# Altium project karmanDB_pcb.PrjPcb (part 1 of 3)
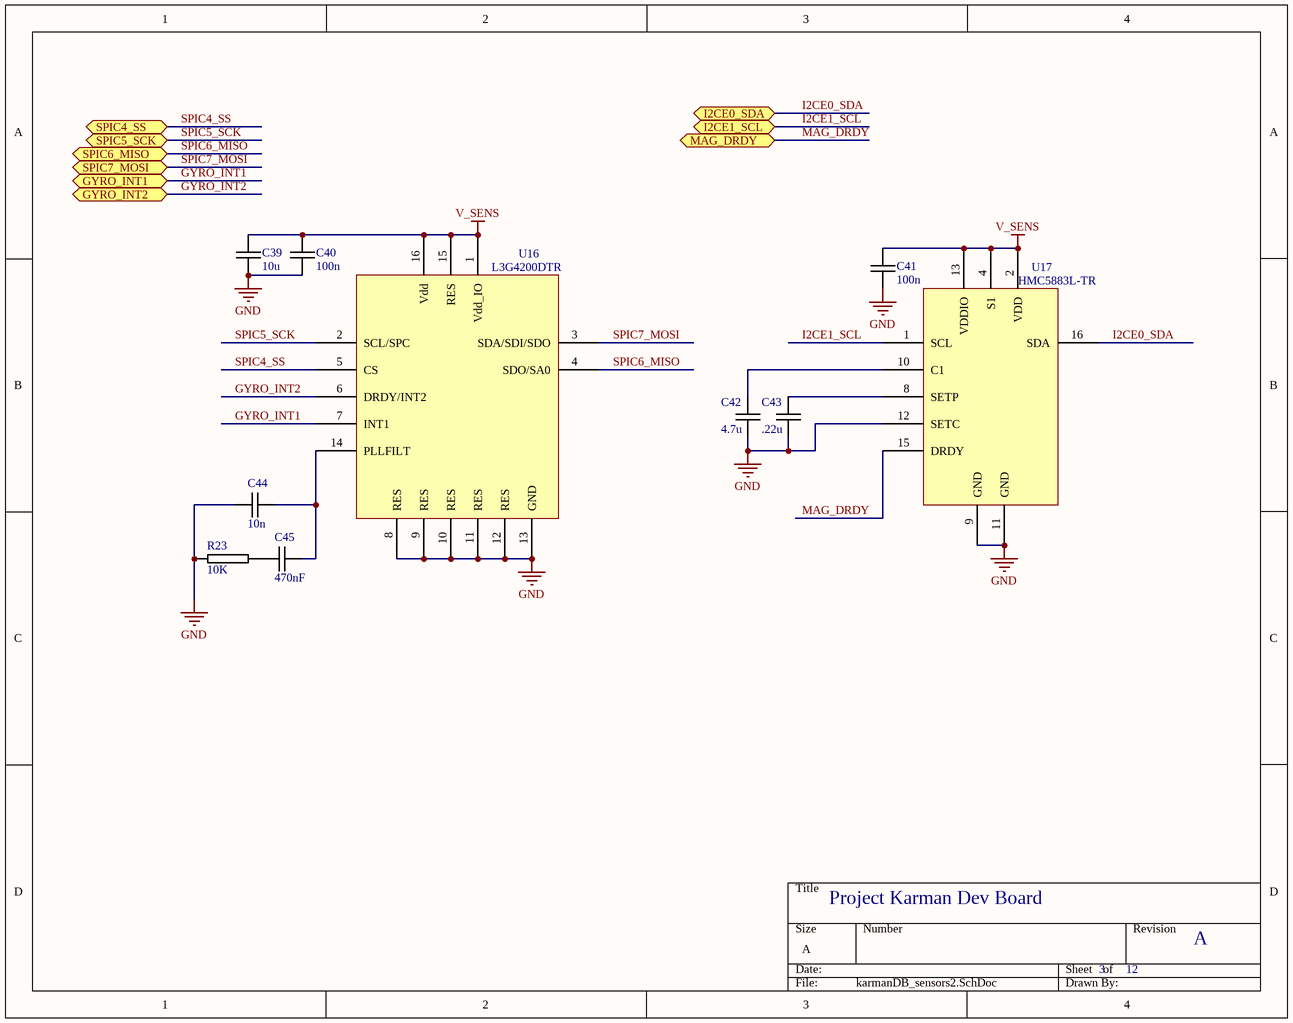
[diagram p0: karmanDB_sensors2.SchDoc]
12 sheets, 205 parts. Net scope: flat (ports and power ports of the same name join across sheets).
Board file: karmanDB.PcbDoc
Sheets:
  karmanDB_sensors2.SchDoc
  karmanDB_accel.SchDoc
  karmanDB_sensors1.SchDoc
  karmanDB_MCU.SchDoc
  karmanDB_power.SchDoc
  karmanDB_transceiver.SchDoc
  karmanDB_mem.SchDoc
  karmanDB_gps&gs.SchDoc
  karmanDB_camera.SchDoc
  karmanDB_amp.SchDoc
  karmanDB_pyro.SchDoc
  karmanDB_testpoints.SchDoc

## Sheet karmanDB_sensors2.SchDoc
size A

### Parts
C39  10u  [MURATA_GRM_0603]
C40  100n  [MURATA_GRM_0603]
C41  100n  [MURATA_GRM_0603]
C42  4.7u  [MURATA_GRM_0603]
C43  .22u  [MURATA_GRM_0603]
C44  10n  [MURATA_GRM_0402]
C45  470nF  [MURATA_GRM_0402]
R23  10K  [PANASONIC_ERJ3R]
U16  L3G4200DTR  [4 L3G4200D]
U17  HMC5883L-TR  [5 HMC5883L-TR]

### Ports
GYRO_INT1 (bidir), GYRO_INT2 (bidir), I2CE0_SDA (bidir), I2CE1_SCL (bidir), MAG_DRDY (bidir), SPIC4_SS (bidir), SPIC5_SCK (bidir), SPIC6_MISO (bidir), SPIC7_MOSI (bidir)

### Nets
GND: C39.2 C40.2 C41.2 C42.2 C43.2 C44.1 R23.1 U16.8(RES) U16.9(RES) U16.10(RES) U16.11(RES) U16.12(RES) U16.13(GND) U17.9(GND) U17.11(GND) U17.12(SETC)
V_SENS: C39.1 C40.1 C41.1 U16.1(Vdd_IO) U16.15(RES) U16.16(Vdd) U17.2(VDD) U17.4(S1) U17.13(VDDIO)
GYRO_INT1: U16.7(INT1) ; port GYRO_INT1
GYRO_INT2: U16.6(DRDY/INT2) ; port GYRO_INT2
I2CE0_SDA: U17.16(SDA) ; port I2CE0_SDA
I2CE1_SCL: U17.1(SCL) ; port I2CE1_SCL
MAG_DRDY: U17.15(DRDY) ; port MAG_DRDY
SPIC4_SS: U16.5(CS) ; port SPIC4_SS
SPIC5_SCK: U16.2(SCL/SPC) ; port SPIC5_SCK
SPIC6_MISO: U16.4(SDO/SA0) ; port SPIC6_MISO
SPIC7_MOSI: U16.3(SDA/SDI/SDO) ; port SPIC7_MOSI
NetC42_1: C42.1 U17.10(C1)
NetC43_1: C43.1 U17.8(SETP)
NetC44_2: C44.2 C45.2 U16.14(PLLFILT)
NetC45_1: C45.1 R23.2

### Notes on the sheet
- Project Karman Dev Board
- 3
- 12
- A

### Library data of the parts
C39 = CAP_MURATA_GRM188R60J106: CAP CER 10UF 6.3V 20% X5R 0603; Manufacturer: Murata Electronics North America; Manufacturer Part Number: GRM188R60J106ME47J; Capacitance: 10µF; Supplier 1: Digi-Key; Supplier Part Number 1: 490-6405-1-ND; RoHS: RoHS Compliant; Category: Capacitors; Stock 1: 159118; Pricing: 1=0.19, 10=0.128, 50=0.0776, 100=0.0651, 250=0.05272, 500=0.0465, 1000=0.03953, 5000=0.03333 (USD); Packaging: Cut Tape (CT); Tolerance: ±20%; Voltage - Rated: 6.3V; Temperature Coefficient: X5R; Mounting Type: Surface Mount, MLCC; Operating Temperature: -55°C ~ 85°C; Applications: General Purpose; Ratings: -; Package / Case: 0603 (1608 Metric); Size / Dimension: 0.063" L x 0.031" W (1.60mm x 0.80mm); Height - Seated (Max): -; Thickness (Max): 0.035" (0.90mm); Lead Spacing: -; Features: -; Lead Style: -; ComponentLink1URL: http://www.murata.com/~/media/webrenewal/support/library/catalog/products/capacitor/mlcc/c02e.ashx; ComponentLink1Description: http://www.murata.com/~/media/webrenewal/support/library/catalog/products/capacitor/mlcc/c02e.ashx
C40 = CAP_MURATA_GRM188R70J104KA01D: CAP CER 0.1UF 6.3V 10% X7R 0603; Manufacturer: Murata Electronics North America; Capacitance: 0.1µF; Supplier 1: Digi-Key; Supplier Part Number 1: 490-9730-1-ND; Manufacturer Part Number: GRM188R70J104KA01D; RoHS: RoHS Compliant; Category: Capacitors; Stock 1: 25826; Pricing: 1=0.1, 10=0.061, 50=0.0332, 100=0.0281, 250=0.02296, 500=0.01964, 1000=0.0153 (USD); Packaging: Cut Tape (CT); Tolerance: ±10%; Voltage - Rated: 6.3V; Temperature Coefficient: X7R; Mounting Type: Surface Mount, MLCC; Operating Temperature: -55°C ~ 125°C; Applications: General Purpose; Ratings: -; Package / Case: 0603 (1608 Metric); Size / Dimension: 0.063" L x 0.031" W (1.60mm x 0.80mm); Height - Seated (Max): -; Thickness (Max): 0.035" (0.90mm); Lead Spacing: -; Features: -; Lead Style: -; ComponentLink1URL: http://www.murata.com/~/media/webrenewal/support/library/catalog/products/capacitor/mlcc/c02e.ashx; ComponentLink1Description: http://www.murata.com/~/media/webrenewal/support/library/catalog/products/capacitor/mlcc/c02e.ashx
C41 = CAP_MURATA_GRM188R71C104KA01D: CAP CER 0.1UF 16V 10% X7R 0603; Manufacturer: Murata Electronics North America; Capacitance: 0.1µF; Supplier 1: Digi-Key; Supplier Part Number 1: 490-1532-1-ND; Manufacturer Part Number: GRM188R71C104KA01D; RoHS: RoHS Compliant; Category: Capacitors; Stock 1: 2486193; Pricing: 1=0.1, 10=0.019, 50=0.0102, 100=0.0086, 250=0.00704, 500=0.006, 1000=0.00468 (USD); Packaging: Cut Tape (CT); Tolerance: ±10%; Voltage - Rated: 16V; Temperature Coefficient: X7R; Mounting Type: Surface Mount, MLCC; Operating Temperature: -55°C ~ 125°C; Applications: General Purpose; Ratings: -; Package / Case: 0603 (1608 Metric); Size / Dimension: 0.063" L x 0.031" W (1.60mm x 0.80mm); Height - Seated (Max): -; Thickness (Max): 0.035" (0.90mm); Lead Spacing: -; Features: -; Lead Style: -; ComponentLink1URL: http://www.murata.com/~/media/webrenewal/support/library/catalog/products/capacitor/mlcc/c02e.ashx; ComponentLink1Description: http://www.murata.com/~/media/webrenewal/support/library/catalog/products/capacitor/mlcc/c02e.ashx
C42 = CAP_MURATA_GRM188R61C475MAAJD: CAP CER 4.7UF 16V 20% X5R 0603; Manufacturer: Murata Electronics North America; Capacitance: 4.7µF; Supplier 1: Digi-Key; Supplier Part Number 1: 490-10482-1-ND; Manufacturer Part Number: GRM188R61C475MAAJD; RoHS: RoHS Compliant; Category: Capacitors; Stock 1: 3465; Pricing: 1=0.3, 10=0.251, 25=0.1728, 50=0.1414, 100=0.1256, 250=0.0942, 500=0.08322, 1000=0.07379 (USD); Packaging: Cut Tape (CT); Tolerance: ±20%; Voltage - Rated: 16V; Temperature Coefficient: X5R; Mounting Type: Surface Mount, MLCC; Operating Temperature: -55°C ~ 85°C; Applications: General Purpose; Ratings: -; Package / Case: 0603 (1608 Metric); Size / Dimension: 0.063" L x 0.031" W (1.60mm x 0.80mm); Height - Seated (Max): -; Thickness (Max): 0.037" (0.95mm); Lead Spacing: -; Features: -; Lead Style: -; ComponentLink1URL: http://www.murata.com/~/media/webrenewal/support/library/catalog/products/capacitor/mlcc/c02e.ashx; ComponentLink1Description: http://www.murata.com/~/media/webrenewal/support/library/catalog/products/capacitor/mlcc/c02e.ashx
C43 = CAP_MURATA_GRM188R71E224KA88D: CAP CER 0.22UF 25V 10% X7R 0603; Manufacturer: Murata Electronics North America; Capacitance: 0.22µF; Supplier 1: Digi-Key; Manufacturer Part Number: GRM188R71E224KA88D; RoHS: RoHS Compliant; Category: Capacitors; Stock 1: 267892; Pricing 1: 1=0.14, 10=0.098, 50=0.0564, 100=0.0466, 250=0.0392, 500=0.03284, 1000=0.02695 (USD); Packaging: Cut Tape (CT); Tolerance: ±10%; Voltage - Rated: 25V; Temperature Coefficient: X7R; Mounting Type: Surface Mount, MLCC; Operating Temperature: -55°C ~ 125°C; Applications: General Purpose; Ratings: -; Package / Case: 0603 (1608 Metric); Size / Dimension: 0.063" L x 0.031" W (1.60mm x 0.80mm); Height - Seated (Max): -; Thickness (Max): 0.035" (0.90mm); Lead Spacing: -; Features: -; Lead Style: -; ComponentLink1URL: http://www.murata.com/~/media/webrenewal/support/library/catalog/products/capacitor/mlcc/c02e.ashx; ComponentLink1Description: http://www.murata.com/~/media/webrenewal/support/library/catalog/products/capacitor/mlcc/c02e.ashx; Supplier Part Number 1: 490-3290-1-ND
C44 = CAP_MURATA_GRM155R71C103KA01D: CAP CER 10000PF 16V 10% X7R 0402; Manufacturer: Murata Electronics North America; Supplier 1: Digi-Key; Supplier Part Number 1: 490-1313-1-ND; Manufacturer Part Number: GRM155R71C103KA01D; RoHS: RoHS Compliant; Category: Capacitors; Stock 1: 2877462; Pricing: 1=0.1, 10=0.012, 50=0.0066, 100=0.0057, 250=0.00464, 500=0.00396, 1000=0.00309, 5000=0.00258 (USD); Packaging: Cut Tape (CT); Capacitance: 10000pF; Tolerance: ±10%; Voltage - Rated: 16V; Temperature Coefficient: X7R; Mounting Type: Surface Mount, MLCC; Operating Temperature: -55°C ~ 125°C; Applications: General Purpose; Ratings: -; Package / Case: 0402 (1005 Metric); Size / Dimension: 0.039" L x 0.020" W (1.00mm x 0.50mm); Height - Seated (Max): -; Thickness (Max): 0.022" (0.55mm); Lead Spacing: -; Features: -; Lead Style: -; ComponentLink1URL: http://www.murata.com/~/media/webrenewal/support/library/catalog/products/capacitor/mlcc/c02e.ashx; ComponentLink1Description: http://www.murata.com/~/media/webrenewal/support/library/catalog/products/capacitor/mlcc/c02e.ashx
C45 = CAP_MURATA_GRT155R61C474KE01D: CAP CER 0.47UF 16V 10% X5R 0402; Manufacturer: Murata Electronics North America; Capacitance: 0.47µF; Supplier 1: Digi-Key; Manufacturer Part Number: GRT155R61C474KE01D; RoHS: RoHS Compliant; Category: Capacitors; Stock 1: 0; Pricing 1: 10000=0.01176, 20000=0.0112, 30000=0.01064, 50000=0.00952, 100000=0.0077 (USD); Packaging: Tape & Reel (TR); Tolerance: ±10%; Voltage - Rated: 16V; Temperature Coefficient: X5R; Mounting Type: Surface Mount, MLCC; Operating Temperature: -55°C ~ 85°C; Applications: Automotive; Ratings: AEC-Q200; Package / Case: 0402 (1005 Metric); Size / Dimension: 0.039" L x 0.020" W (1.00mm x 0.50mm); Height - Seated (Max): -; Thickness (Max): 0.022" (0.55mm); Lead Spacing: -; Features: -; Lead Style: -; ComponentLink1URL: http://search.murata.co.jp/Ceramy/image/img/A01X/G101/ENG/GRT155R61C474KE01-01.pdf; ComponentLink1Description: http://search.murata.co.jp/Ceramy/image/img/A01X/G101/ENG/GRT155R61C474KE01-01.pdf; Supplier Part Number 1: 490-12261-2-ND
R23 = RES_PANASONIC_ERJ-3GEYJ103V: RES SMD 10K OHM 5% 1/10W 0603; Manufacturer: Panasonic Electronic Components; Power (Watts): 0.1W, 1/10W; Temperature Coefficient: ±200ppm/°C; Supplier 1: Digi-Key; Supplier Part Number 1: P10KGCT-ND; Manufacturer Part Number: ERJ-3GEYJ103V; RoHS: RoHS Compliant; Category: Resistors; Stock 1: 4229597; Pricing: 1=0.1, 50=0.0096, 100=0.0071, 250=0.00544, 500=0.00436, 1000=0.00321 (USD); Packaging: Cut Tape (CT); Resistance (Ohms): 10k; Tolerance: ±5%; Composition: Thick Film; Features: Automotive AEC-Q200; Operating Temperature: -55°C ~ 155°C; Package / Case: 0603 (1608 Metric); Supplier Device Package: 0603; Size / Dimension: 0.063" L x 0.031" W (1.60mm x 0.80mm); Height: 0.022" (0.55mm); Number of Terminations: 2; ComponentLink1URL: http://industrial.panasonic.com/www-cgi/jvcr13pz.cgi?E+PZ+3+AOA0001+ERJ3GEYJ103V+7+WW; ComponentLink1Description: http://industrial.panasonic.com/www-cgi/jvcr13pz.cgi?E+PZ+3+AOA0001+ERJ3GEYJ103V+7+WW
U16 = L3G4200DTR: IC GYROSCOPE MEMS 3AXIS LP 16LGA; Manufacturer: STMicroelectronics; Range °/s: ±250°/s, ±500°/s, ±2000°/s; Sensitivity: 70m°/s, 17.5m°/s, 8.75m°/s; Typical Bandwidth: 800Hz, 400Hz, 200Hz, 100Hz; Voltage - Supply: 2.4 V ~ 3.6 V; Current - Supply: 6.1mA; Output Type: I²C, SPI; Supplier 1: Digi-Key; Manufacturer Part Number: L3G4200DTR; RoHS: RoHS Compliant; Category: Sensors, Transducers; Stock 1: 5355; Pricing 1: 1=5.28, 10=4.25, 100=3.77, 250=3.48, 500=3.13, 1000=2.64001 (USD); Operating Temperature: -40°C ~ 85°C; Package / Case: 16-TFLGA; Supplier Device Package: 16-LGA (4x4); ComponentLink1URL: http://www.st.com/web/en/resource/technical/document/datasheet/CD00265057.pdf; ComponentLink1Description: http://www.st.com/web/en/resource/technical/document/datasheet/CD00265057.pdf; Supplier Part Number 1: 497-11071-1-ND
U17 = HMC5883L-TR: IC COMPASS 3 AXIS I2C 16LCC SMD; Manufacturer: Honeywell Microelectronics & Precision Sensors; Sensing Range: ±8G; Voltage - Supply: 2.16 V ~ 3.6 V; Current - Supply: 100µA; Output Type: I²C; Supplier 1: Digi-Key; Manufacturer Part Number: HMC5883L-TR; RoHS: RoHS Compliant; Category: Sensors, Transducers; Stock 1: 15448; Pricing 1: 1=3.3, 10=2.258, 25=2.0316, 50=1.902, 100=1.7963, 250=1.683, 500=1.6104, 1000=1.5477 (USD); Packaging: Cut Tape (CT); Type: Compass - Three Axis; Current - Output (Max): -; Features: Compass - Three Axis; Operating Temperature: -30°C ~ 85°C; Package / Case: 16-LCC; Supplier Device Package: 16-LCC; ComponentLink1URL: http://www51.honeywell.com/aero/common/documents/myaerospacecatalog-documents/Defense_Brochures-documents/HMC5883L_3-Axis_Digital_Compass_IC.pdf; ComponentLink1Description: http://www51.honeywell.com/aero/common/documents/myaerospacecatalog-documents/Defense_Brochures-documents/HMC5883L_3-Axis_Digital_Compass_IC.pdf; Supplier Part Number 1: 342-1082-1-ND

## Sheet karmanDB_accel.SchDoc
size A
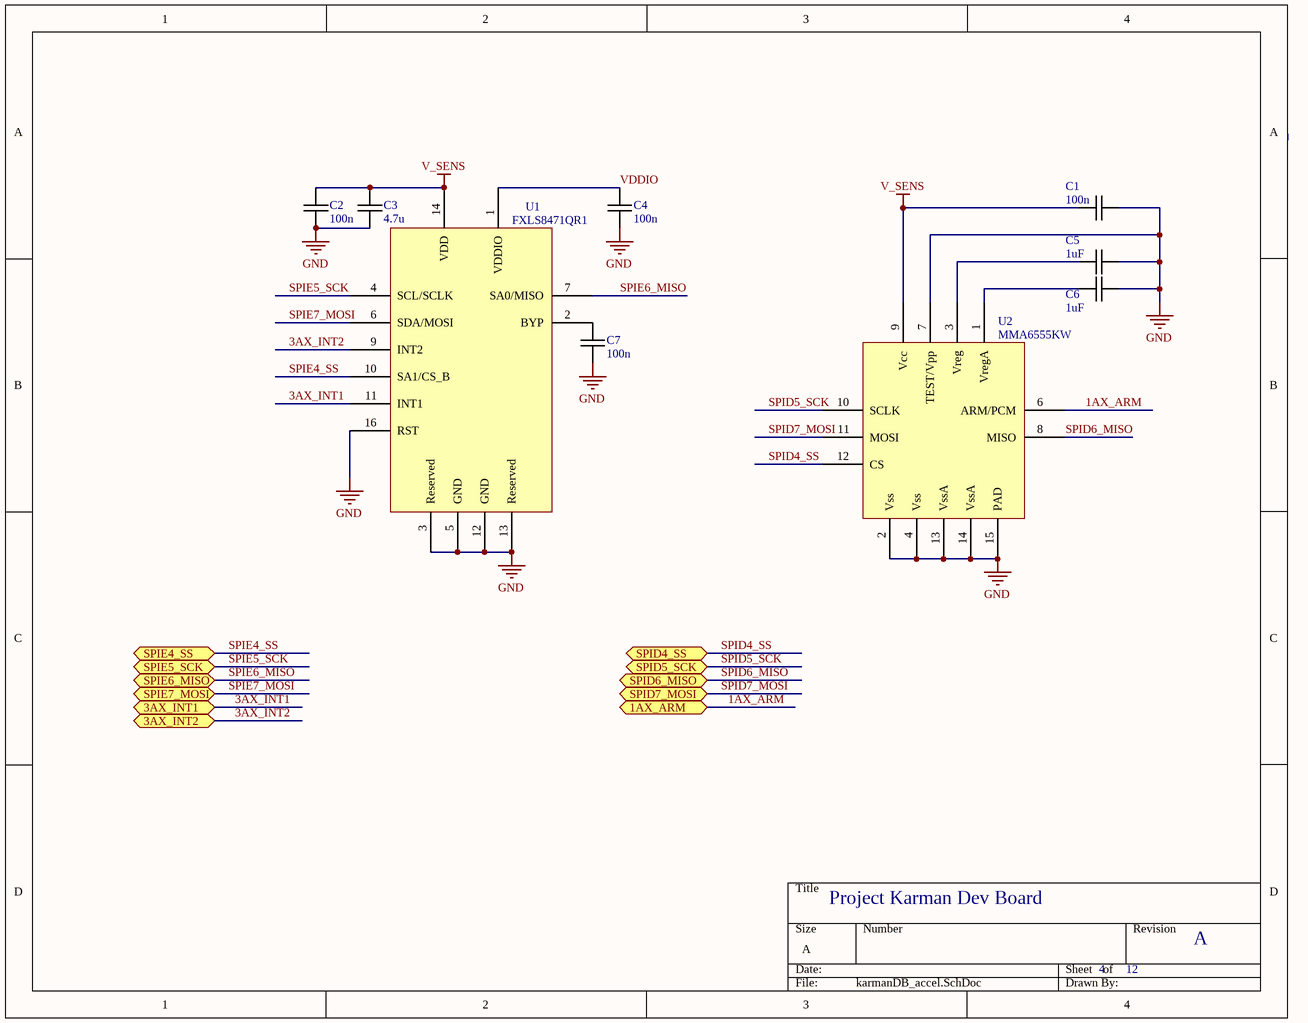
[diagram p1: karmanDB_accel.SchDoc]

### Parts
C1  100n  [MURATA_GRM_0603]
C2  100n  [MURATA_GRM_0603]
C3  4.7u  [MURATA_GRM_0603]
C4  100n  [MURATA_GRM_0603]
C5  1uF  [MURATA_GRM_0402]
C6  1uF  [MURATA_GRM_0402]
C7  100n  [MURATA_GRM_0603]
U1  FXLS8471QR1  [3 FXLS8471QR1]
U2  MMA6555KW  [6 MMA6555KW]

### Ports
1AX_ARM (bidir), 3AX_INT1 (bidir), 3AX_INT2 (bidir), SPID4_SS (bidir), SPID5_SCK (bidir), SPID6_MISO (bidir), SPID7_MOSI (bidir), SPIE4_SS (bidir), SPIE5_SCK (bidir), SPIE6_MISO (bidir), SPIE7_MOSI (bidir)

### Nets
GND: C1.2 C2.2 C3.2 C4.2 C5.1 C6.1 C7.2 U1.3(Reserved) U1.5(GND) U1.12(GND) U1.13(Reserved) U1.16(RST) U2.2(Vss) U2.4(Vss) U2.7(TEST/Vpp) U2.13(VssA) U2.14(VssA) U2.15(PAD)
V_SENS: C1.1 C2.1 C3.1 U1.14(VDD) U2.9(Vcc)
1AX_ARM: U2.6(ARM/PCM) ; port 1AX_ARM
3AX_INT1: U1.11(INT1) ; port 3AX_INT1
3AX_INT2: U1.9(INT2) ; port 3AX_INT2
SPID4_SS: U2.12(CS) ; port SPID4_SS
SPID5_SCK: U2.10(SCLK) ; port SPID5_SCK
SPID6_MISO: U2.8(MISO) ; port SPID6_MISO
SPID7_MOSI: U2.11(MOSI) ; port SPID7_MOSI
SPIE4_SS: U1.10(SA1/CS_B) ; port SPIE4_SS
SPIE5_SCK: U1.4(SCL/SCLK) ; port SPIE5_SCK
SPIE6_MISO: U1.7(SA0/MISO) ; port SPIE6_MISO
SPIE7_MOSI: U1.6(SDA/MOSI) ; port SPIE7_MOSI
VDDIO: C4.1 U1.1(VDDIO)
NetC5_2: C5.2 U2.3(Vreg)
NetC6_2: C6.2 U2.1(VregA)
NetC7_1: C7.1 U1.2(BYP)

Not connected (* = marked no-connect by the designer): U1 8(N/C) 15(N/C)

### Notes on the sheet
- Project Karman Dev Board
- 4
- 12
- A

### Library data of the parts
C1 C2 C4 C7 = CAP_MURATA_GRM188R71C104KA01D: as C41 on sheet karmanDB_sensors2; Supplier 1: Digi-Key; Supplier Part Number 1: 490-1532-1-ND; Manufacturer Part Number: GRM188R71C104KA01D; RoHS: RoHS Compliant; Category: Capacitors; Stock 1: 2486193; Pricing: 1=0.1, 10=0.019, 50=0.0102, 100=0.0086, 250=0.00704, 500=0.006, 1000=0.00468 (USD); Packaging: Cut Tape (CT); Tolerance: ±10%; Voltage - Rated: 16V; Temperature Coefficient: X7R; Mounting Type: Surface Mount, MLCC; Operating Temperature: -55°C ~ 125°C; Applications: General Purpose; Ratings: -; Package / Case: 0603 (1608 Metric); Size / Dimension: 0.063" L x 0.031" W (1.60mm x 0.80mm); Height - Seated (Max): -; Thickness (Max): 0.035" (0.90mm); Lead Spacing: -; Features: -; Lead Style: -; ComponentLink1URL: http://www.murata.com/~/media/webrenewal/support/library/catalog/products/capacitor/mlcc/c02e.ashx; ComponentLink1Description: http://www.murata.com/~/media/webrenewal/support/library/catalog/products/capacitor/mlcc/c02e.ashx
C3 = CAP_MURATA_GRM188R61C475MAAJD: as C42 on sheet karmanDB_sensors2; Supplier 1: Digi-Key; Supplier Part Number 1: 490-10482-1-ND; Manufacturer Part Number: GRM188R61C475MAAJD; RoHS: RoHS Compliant; Category: Capacitors; Stock 1: 3465; Pricing: 1=0.3, 10=0.251, 25=0.1728, 50=0.1414, 100=0.1256, 250=0.0942, 500=0.08322, 1000=0.07379 (USD); Packaging: Cut Tape (CT); Tolerance: ±20%; Voltage - Rated: 16V; Temperature Coefficient: X5R; Mounting Type: Surface Mount, MLCC; Operating Temperature: -55°C ~ 85°C; Applications: General Purpose; Ratings: -; Package / Case: 0603 (1608 Metric); Size / Dimension: 0.063" L x 0.031" W (1.60mm x 0.80mm); Height - Seated (Max): -; Thickness (Max): 0.037" (0.95mm); Lead Spacing: -; Features: -; Lead Style: -; ComponentLink1URL: http://www.murata.com/~/media/webrenewal/support/library/catalog/products/capacitor/mlcc/c02e.ashx; ComponentLink1Description: http://www.murata.com/~/media/webrenewal/support/library/catalog/products/capacitor/mlcc/c02e.ashx
C5 C6 = CAP_MURATA_GRM155R61A105KE15D: CAP CER 1uF 10volts X5R 10% 0402; Manufacturer: Murata Electronics; Type: General Purpose MLCC; Voltage Rating DC: 10 V; Supplier 1: Mouser; Manufacturer Part Number: GRM155R61A105KE15D; RoHS: RoHS Compliant; Category: Multilayer Ceramic Capacitors MLCC - SMD/SMT; Stock 1: 726006; Pricing 1: 1=0.528, 10=0.066, 100=0.038, 1000=0.030, 2500=0.026, 10000=0.021, 20000=0.019, 50000=0.016, 100000=0.014 (AUD); Capacitance: 1 uF; Height: 0.5 mm; Length: 1 mm; Package / Case: 0402 (1005 metric); Packaging: Reel; Product: General Type MLCCs; Series: GRM; Termination Style: SMD/SMT; Tolerance: 10 %; Width: 0.5 mm; Brand: Murata Electronics; Case Code - in: 0402; Case Code - mm: 1005; Dielectric: X5R; Maximum Operating Temperature: + 85 C; Minimum Operating Temperature: - 55 C; Product Category: High Capacitance SMD Ceramic Chip Capacitors; Standard Pack Qty: 10000; RoHS - Mouser: Y; Minimum Order Quantity: 1; Reeling: True; ComponentLink1URL: http://www.mouser.com/ds/2/281/c02e-2905.pdf; ComponentLink1Description: http://www.mouser.com/ds/2/281/c02e-2905.pdf; Supplier Part Number 1: 81-GRM155R61A105KE15
U1 = FXLS8471QR1: ACCELEROMETER LOW G 3-AXIS DFN; Manufacturer: Freescale Semiconductor; Axis: X, Y, Z; Acceleration Range: ±2g, 4g, 8g; Voltage - Supply: 1.95 V ~ 3.6 V; Output Type: SPI; Bandwidth: 1.5kHz; Interface: I²C, SPI; Supplier 1: Digi-Key; Manufacturer Part Number: FXLS8471QR1; RoHS: RoHS Compliant; Category: Sensors, Transducers; Stock 1: 2987; Pricing 1: 1=1.99, 10=1.775, 25=1.6684, 100=1.5975, 250=1.52652, 500=1.42 (USD); Packaging: Cut Tape (CT); Sensitivity: -; Mounting Type: Surface Mount; Package / Case: 16-VFQFN; Supplier Device Package: 16-QFN (3x3); ComponentLink1URL: http://cache.freescale.com/files/sensors/doc/data_sheet/FXLS8471Q.pdf; ComponentLink1Description: http://cache.freescale.com/files/sensors/doc/data_sheet/FXLS8471Q.pdf; Supplier Part Number 1: FXLS8471QR1CT-ND
U2 = MMA6555KW: Accelerometers X-AXIS 100G; Manufacturer: Freescale Semiconductor; Output Type: Digital; Resolution: 12 bit; Sensitivity: 18.2 LSB/g; Acceleration: 105 g; Interface Type: SPI; Sensing Axis: Single; Operating Supply Current: 7 mA; Supply Voltage - Max: 5 V; Supply Voltage - Min: 3.3 V; Supplier 1: Mouser; Manufacturer Part Number: MMA6555KW; RoHS: RoHS Compliant By Exemption; Category: Accelerometers; Stock 1: 207; Pricing 1: 1=9.30, 10=8.78, 25=8.26, 100=6.19 (AUD); Package / Case: QFN-16; Packaging: Tube; Series: MMA65xx; Brand: Freescale Semiconductor; Standard Pack Qty: 75; RoHS - Mouser: E; Minimum Order Quantity: 1; Reeling: False; ComponentLink1URL: http://www.mouser.com/ds/2/161/MMA655x-482708.pdf; ComponentLink1Description: http://www.mouser.com/ds/2/161/MMA655x-482708.pdf; Supplier Part Number 1: 841-MMA6555KW

## Sheet karmanDB_sensors1.SchDoc
size A
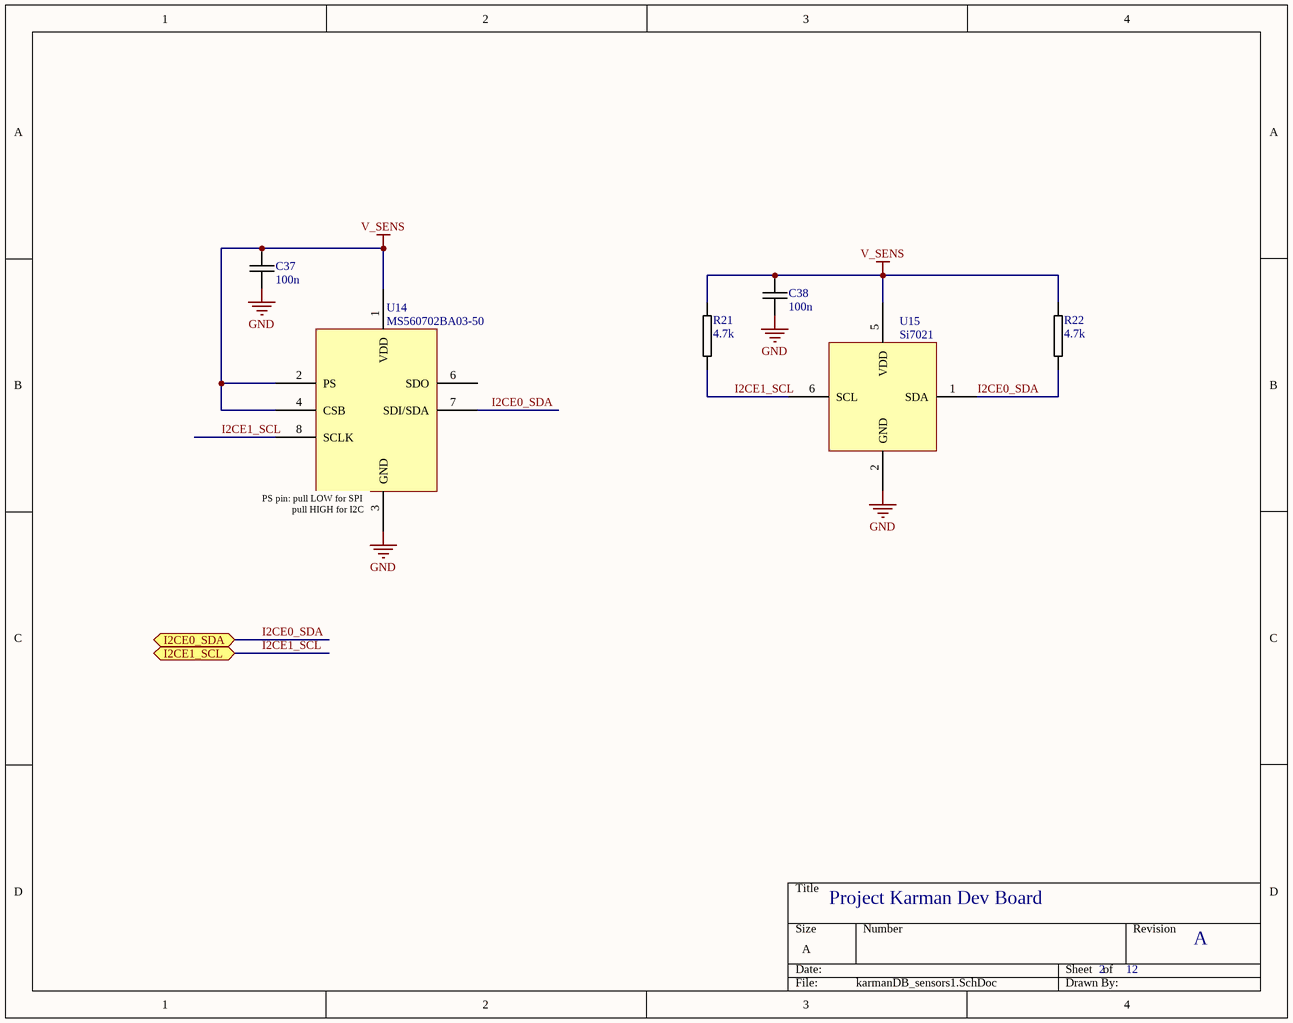
[diagram p2: karmanDB_sensors1.SchDoc]

### Parts
C37  100n  [MURATA_GRM_0603]
C38  100n  [MURATA_GRM_0603]
R21  4.7k  [PANASONIC_ERJ2R_SERIES]
R22  4.7k  [PANASONIC_ERJ2R_SERIES]
U14  MS560702BA03-50  [8 MS560702BA03-50]
U15  Si7021  [7 Si7021-A20]

### Ports
I2CE0_SDA (bidir), I2CE1_SCL (bidir)

### Nets
GND: C37.2 C38.2 U14.3(GND) U15.2(GND)
V_SENS: C37.1 C38.1 R21.1 R22.1 U14.1(VDD) U14.2(PS) U14.4(CSB) U15.5(VDD)
I2CE0_SDA: R22.2 U14.7(SDI/SDA) U15.1(SDA) ; port I2CE0_SDA
I2CE1_SCL: R21.2 U14.8(SCLK) U15.6(SCL) ; port I2CE1_SCL

Not connected (* = marked no-connect by the designer): U14 6(SDO); U15 3(DNC) 4(DNC)

### Notes on the sheet
- (near U14) PS pin: pull LOW for SPI
  pull HIGH for I2C
- Project Karman Dev Board
- 2
- 12
- A

### Library data of the parts
C37 C38 = CAP_MURATA_GRM188R71C104KA01D: as C41 on sheet karmanDB_sensors2; Supplier 1: Digi-Key; Supplier Part Number 1: 490-1532-1-ND; Manufacturer Part Number: GRM188R71C104KA01D; RoHS: RoHS Compliant; Category: Capacitors; Stock 1: 2486193; Pricing: 1=0.1, 10=0.019, 50=0.0102, 100=0.0086, 250=0.00704, 500=0.006, 1000=0.00468 (USD); Packaging: Cut Tape (CT); Tolerance: ±10%; Voltage - Rated: 16V; Temperature Coefficient: X7R; Mounting Type: Surface Mount, MLCC; Operating Temperature: -55°C ~ 125°C; Applications: General Purpose; Ratings: -; Package / Case: 0603 (1608 Metric); Size / Dimension: 0.063" L x 0.031" W (1.60mm x 0.80mm); Height - Seated (Max): -; Thickness (Max): 0.035" (0.90mm); Lead Spacing: -; Features: -; Lead Style: -; ComponentLink1URL: http://www.murata.com/~/media/webrenewal/support/library/catalog/products/capacitor/mlcc/c02e.ashx; ComponentLink1Description: http://www.murata.com/~/media/webrenewal/support/library/catalog/products/capacitor/mlcc/c02e.ashx
R21 R22 = RES_PANASONIC_ERJ-2RKF4701X: RES SMD 4.7K OHM 1% 1/10W 0402; Manufacturer: Panasonic Electronic Components; Power (Watts): 0.1W, 1/10W; Temperature Coefficient: ±100ppm/°C; Supplier 1: Digi-Key; Manufacturer Part Number: ERJ-2RKF4701X; RoHS: RoHS Compliant; Category: Resistors; Stock 1: 2910000; Pricing 1: 10000=0.00281, 30000=0.00247, 50000=0.00226, 100000=0.00222 (USD); Packaging: Tape & Reel (TR); Resistance (Ohms): 4.7k; Tolerance: ±1%; Composition: Thick Film; Features: Automotive AEC-Q200; Operating Temperature: -55°C ~ 155°C; Package / Case: 0402 (1005 Metric); Supplier Device Package: 0402; Size / Dimension: 0.039" L x 0.020" W (1.00mm x 0.50mm); Height: 0.016" (0.40mm); Number of Terminations: 2; ComponentLink1URL: http://industrial.panasonic.com/www-cgi/jvcr13pz.cgi?E+PZ+3+AOA0002+ERJ2RKF4701X+7+WW; ComponentLink1Description: http://industrial.panasonic.com/www-cgi/jvcr13pz.cgi?E+PZ+3+AOA0002+ERJ2RKF4701X+7+WW; Supplier Part Number 1: P4.70KLTR-ND
U14 = MS560702BA03-50: BAROMETRIC PRESSURE SENSOR; Manufacturer: TE Connectivity Measurement Specialties; Pressure Type: Absolute; Operating Pressure: 0.15 PSI ~ 17.4 PSI (1 kPa ~ 120 kPa); Output Type: I²C, SPI; Output: 24 b; Accuracy: ±0.022 PSI (±0.15 kPa); Voltage - Supply: 1.8 V ~ 3.6 V; Port Style: No Port; Maximum Pressure: 87.02 PSI (600 kPa); Supplier 1: Digi-Key; Manufacturer Part Number: MS560702BA03-50; RoHS: RoHS Compliant; Category: Sensors, Transducers; Stock 1: 9112; Pricing 1: 1=5.98, 10=4.664, 25=3.784, 50=3.344, 100=3.256, 250=2.992, 500=2.728, 750=2.64, 1000=2.552 (USD); Port Size: -; Features: -; Termination Style: *; Operating Temperature: -40°C ~ 85°C; Package / Case: *; Supplier Device Package: *; ComponentLink1URL: http://www.meas-spec.com/downloads/MS5607-02BA03.pdf; ComponentLink1Description: http://www.meas-spec.com/downloads/MS5607-02BA03.pdf; Supplier Part Number 1: 223-1198-1-ND
U15 = SI7021-A20-GM: IC TEMP SENSOR RH 3% 6DFN; Manufacturer: Silicon Labs; Sensor Type: Humidity, Temperature; Humidity Range: 0 ~ 100% RH; Output Type: I²C; Output: 12b; Accuracy: ±3% RH; Response Time: 18S; Voltage - Supply: 1.9 V ~ 3.6 V; Supplier 1: Digi-Key; Manufacturer Part Number: SI7021-A20-GM; RoHS: RoHS Compliant; Category: Sensors, Transducers; Stock 1: 755; Pricing 1: 1=3.87, 25=3.5496, 100=3.227, 1000=2.90426 (USD); Sensitivity: -; Mounting Type: Surface Mount; Operating Temperature: -40°C ~ 85°C; ComponentLink1URL: https://www.silabs.com/Support%20Documents/TechnicalDocs/Si7021-A20.pdf; ComponentLink1Description: https://www.silabs.com/Support%20Documents/TechnicalDocs/Si7021-A20.pdf; Supplier Part Number 1: 336-3140-5-ND

## Sheet karmanDB_MCU.SchDoc
size A
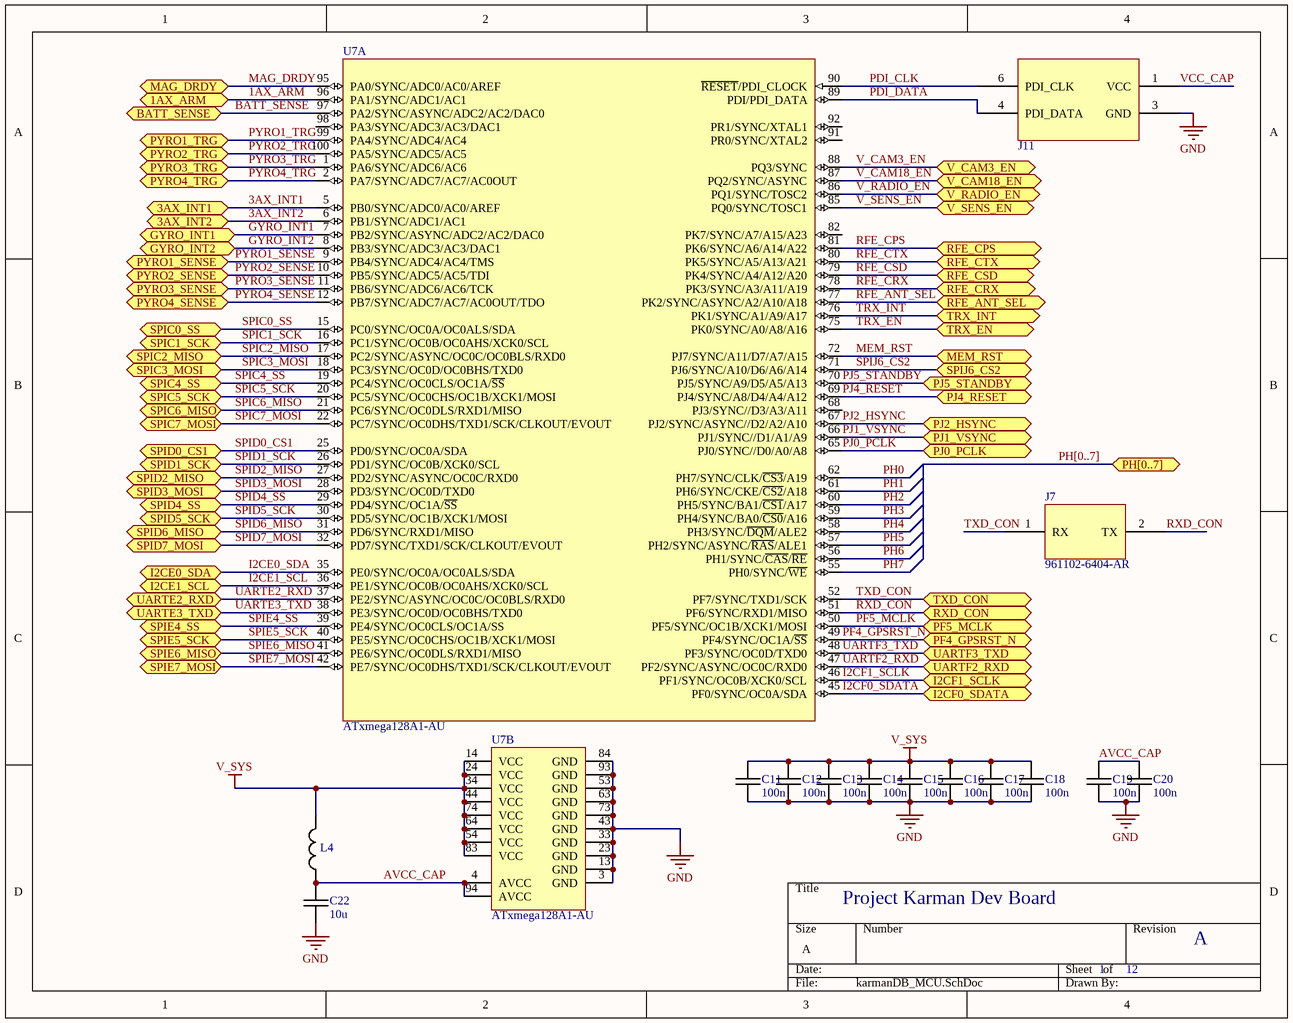
[diagram p3: karmanDB_MCU.SchDoc]

### Parts
C11  100n  [MURATA_GRM_0603]
C12  100n  [MURATA_GRM_0603]
C13  100n  [MURATA_GRM_0603]
C14  100n  [MURATA_GRM_0603]
C15  100n  [MURATA_GRM_0603]
C16  100n  [MURATA_GRM_0603]
C17  100n  [MURATA_GRM_0603]
C18  100n  [MURATA_GRM_0603]
C19  100n  [MURATA_GRM_0603]
C20  100n  [MURATA_GRM_0603]
C22  10u  [MURATA_GRM_0603]
J7  961102-6404-AR  [3M_961102-6X04]
J11  961206-6404-AR  [961206-6404-AR]  (value not drawn)
L4  BLM15BB221SN1D  [BLM15]  (value not drawn)
U7  ATxmega128A1-AU  [100A_N]  (parts A,B of 2)

### Ports
1AX_ARM (bidir), 3AX_INT1 (bidir), 3AX_INT2 (bidir), BATT_SENSE (bidir), GYRO_INT1 (bidir), GYRO_INT2 (bidir), I2CE0_SDA (bidir), I2CE1_SCL (bidir), I2CF0_SDATA (bidir), I2CF1_SCLK (bidir), MAG_DRDY (bidir), MEM_RST (bidir), PF4_GPSRST_N (bidir), PF5_MCLK (bidir), PH[0..7] (bidir), PJ0_PCLK (bidir), PJ1_VSYNC (bidir), PJ2_HSYNC (bidir), PJ4_RESET (bidir), PJ5_STANDBY (bidir), PYRO1_SENSE (bidir), PYRO1_TRG (bidir), PYRO2_SENSE (bidir), PYRO2_TRG (bidir), PYRO3_SENSE (bidir), PYRO3_TRG (bidir), PYRO4_SENSE (bidir), PYRO4_TRG (bidir), RFE_ANT_SEL (bidir), RFE_CPS (bidir), RFE_CRX (bidir), RFE_CSD (bidir), RFE_CTX (bidir), RXD_CON (bidir), SPIC0_SS (bidir), SPIC1_SCK (bidir), SPIC2_MISO (bidir), SPIC3_MOSI (bidir), SPIC4_SS (bidir), SPIC5_SCK (bidir), SPIC6_MISO (bidir), SPIC7_MOSI (bidir), SPID0_CS1 (bidir), SPID1_SCK (bidir), SPID2_MISO (bidir), SPID3_MOSI (bidir), SPID4_SS (bidir), SPID5_SCK (bidir), SPID6_MISO (bidir), SPID7_MOSI (bidir), SPIE4_SS (bidir), SPIE5_SCK (bidir), SPIE6_MISO (bidir), SPIE7_MOSI (bidir), SPIJ6_CS2 (bidir), TRX_EN (bidir), TRX_INT (bidir), TXD_CON (bidir), UARTE2_RXD (bidir), UARTE3_TXD (bidir), UARTF2_RXD (bidir), UARTF3_TXD (bidir), V_CAM3_EN (bidir), V_CAM18_EN (bidir), V_RADIO_EN (bidir), V_SENS_EN (bidir)

### Nets
GND: C11.2 C12.2 C13.2 C14.2 C15.2 C16.2 C17.2 C18.2 C19.2 C20.2 C22.2 J11.3(GND) U7.3(GND) U7.13(GND) U7.23(GND) U7.33(GND) U7.43(GND) U7.53(GND) U7.63(GND) U7.73(GND) U7.84(GND) U7.93(GND)
V_SYS: C11.1 C12.1 C13.1 C14.1 C15.1 C16.1 C17.1 C18.1 L4.2 U7.14(VCC) U7.24(VCC) U7.34(VCC) U7.44(VCC) U7.54(VCC) U7.64(VCC) U7.74(VCC) U7.83(VCC)
1AX_ARM: U7.96(PA1/SYNC/ADC1/AC1) ; port 1AX_ARM
3AX_INT1: U7.5(PB0/SYNC/ADC0/AC0/AREF) ; port 3AX_INT1
3AX_INT2: U7.6(PB1/SYNC/ADC1/AC1) ; port 3AX_INT2
AVCC_CAP: C19.1 C20.1 C22.1 L4.1 U7.4(AVCC) U7.94(AVCC)
BATT_SENSE: U7.97(PA2/SYNC/ASYNC/ADC2/AC2/DAC0) ; port BATT_SENSE
GYRO_INT1: U7.7(PB2/SYNC/ASYNC/ADC2/AC2/DAC0) ; port GYRO_INT1
GYRO_INT2: U7.8(PB3/SYNC/ADC3/AC3/DAC1) ; port GYRO_INT2
I2CE0_SDA: U7.35(PE0/SYNC/OC0A/OC0ALS/SDA) ; port I2CE0_SDA
I2CE1_SCL: U7.36(PE1/SYNC/OC0B/OC0AHS/XCK0/SCL) ; port I2CE1_SCL
I2CF0_SDATA: U7.45(PF0/SYNC/OC0A/SDA) ; port I2CF0_SDATA
I2CF1_SCLK: U7.46(PF1/SYNC/OC0B/XCK0/SCL) ; port I2CF1_SCLK
MAG_DRDY: U7.95(PA0/SYNC/ADC0/AC0/AREF) ; port MAG_DRDY
MEM_RST: U7.72(PJ7/SYNC/A11/D7/A7/A15) ; port MEM_RST
PDI_CLK: J11.6(PDI_CLK) U7.90(~{RESET}/PDI_CLOCK)
PDI_DATA: J11.4(PDI_DATA) U7.89(PDI/PDI_DATA)
PF4_GPSRST_N: U7.49(PF4/SYNC/OC1A/~{SS}) ; port PF4_GPSRST_N
PF5_MCLK: U7.50(PF5/SYNC/OC1B/XCK1/MOSI) ; port PF5_MCLK
PH0: U7.62(PH7/SYNC/CLK/~{CS3}/A19)
PH1: U7.61(PH6/SYNC/CKE/~{CS2}/A18)
PH2: U7.60(PH5/SYNC/BA1/~{CS1}/A17)
PH3: U7.59(PH4/SYNC/BA0/~{CS0}/A16)
PH4: U7.58(PH3/SYNC/~{DQM}/ALE2)
PH5: U7.57(PH2/SYNC/ASYNC/~{RAS}/ALE1)
PH6: U7.56(PH1/SYNC/~{CAS}/~{RE})
PH7: U7.55(PH0/SYNC/~{WE})
PJ0_PCLK: U7.65(PJ0/SYNC//D0/A0/A8) ; port PJ0_PCLK
PJ1_VSYNC: U7.66(PJ1/SYNC//D1/A1/A9) ; port PJ1_VSYNC
PJ2_HSYNC: U7.67(PJ2/SYNC/ASYNC//D2/A2/A10) ; port PJ2_HSYNC
PJ4_RESET: U7.69(PJ4/SYNC/A8/D4/A4/A12) ; port PJ4_RESET
PJ5_STANDBY: U7.70(PJ5/SYNC/A9/D5/A5/A13) ; port PJ5_STANDBY
PYRO1_SENSE: U7.9(PB4/SYNC/ADC4/AC4/TMS) ; port PYRO1_SENSE
PYRO1_TRG: U7.99(PA4/SYNC/ADC4/AC4) ; port PYRO1_TRG  [project net PYRO1_PA4]
PYRO2_SENSE: U7.10(PB5/SYNC/ADC5/AC5/TDI) ; port PYRO2_SENSE
PYRO2_TRG: U7.100(PA5/SYNC/ADC5/AC5) ; port PYRO2_TRG  [project net PYRO2_PA5]
PYRO3_SENSE: U7.11(PB6/SYNC/ADC6/AC6/TCK) ; port PYRO3_SENSE
PYRO3_TRG: U7.1(PA6/SYNC/ADC6/AC6) ; port PYRO3_TRG  [project net PYRO3_PA6]
PYRO4_SENSE: U7.12(PB7/SYNC/ADC7/AC7/AC0OUT/TDO) ; port PYRO4_SENSE
PYRO4_TRG: U7.2(PA7/SYNC/ADC7/AC7/AC0OUT) ; port PYRO4_TRG  [project net PYRO4_PA7]
RFE_ANT_SEL: U7.77(PK2/SYNC/ASYNC/A2/A10/A18) ; port RFE_ANT_SEL
RFE_CPS: U7.81(PK6/SYNC/A6/A14/A22) ; port RFE_CPS
RFE_CRX: U7.78(PK3/SYNC/A3/A11/A19) ; port RFE_CRX
RFE_CSD: U7.79(PK4/SYNC/A4/A12/A20) ; port RFE_CSD
RFE_CTX: U7.80(PK5/SYNC/A5/A13/A21) ; port RFE_CTX
RXD_CON: J7.2(TX) U7.51(PF6/SYNC/RXD1/MISO) ; port RXD_CON
SPIC0_SS: U7.15(PC0/SYNC/OC0A/OC0ALS/SDA) ; port SPIC0_SS
SPIC1_SCK: U7.16(PC1/SYNC/OC0B/OC0AHS/XCK0/SCL) ; port SPIC1_SCK
SPIC2_MISO: U7.17(PC2/SYNC/ASYNC/OC0C/OC0BLS/RXD0) ; port SPIC2_MISO
SPIC3_MOSI: U7.18(PC3/SYNC/OC0D/OC0BHS/TXD0) ; port SPIC3_MOSI
SPIC4_SS: U7.19(PC4/SYNC/OC0CLS/OC1A/~{SS}) ; port SPIC4_SS
SPIC5_SCK: U7.20(PC5/SYNC/OC0CHS/OC1B/XCK1/MOSI) ; port SPIC5_SCK
SPIC6_MISO: U7.21(PC6/SYNC/OC0DLS/RXD1/MISO) ; port SPIC6_MISO
SPIC7_MOSI: U7.22(PC7/SYNC/OC0DHS/TXD1/SCK/CLKOUT/EVOUT) ; port SPIC7_MOSI
SPID0_CS1: U7.25(PD0/SYNC/OC0A/SDA) ; port SPID0_CS1
SPID1_SCK: U7.26(PD1/SYNC/OC0B/XCK0/SCL) ; port SPID1_SCK
SPID2_MISO: U7.27(PD2/SYNC/ASYNC/OC0C/RXD0) ; port SPID2_MISO
SPID3_MOSI: U7.28(PD3/SYNC/OC0D/TXD0) ; port SPID3_MOSI
SPID4_SS: U7.29(PD4/SYNC/OC1A/~{SS}) ; port SPID4_SS
SPID5_SCK: U7.30(PD5/SYNC/OC1B/XCK1/MOSI) ; port SPID5_SCK
SPID6_MISO: U7.31(PD6/SYNC/RXD1/MISO) ; port SPID6_MISO
SPID7_MOSI: U7.32(PD7/SYNC/TXD1/SCK/CLKOUT/EVOUT) ; port SPID7_MOSI
SPIE4_SS: U7.39(PE4/SYNC/OC0CLS/OC1A/SS) ; port SPIE4_SS
SPIE5_SCK: U7.40(PE5/SYNC/OC0CHS/OC1B/XCK1/MOSI) ; port SPIE5_SCK
SPIE6_MISO: U7.41(PE6/SYNC/OC0DLS/RXD1/MISO) ; port SPIE6_MISO
SPIE7_MOSI: U7.42(PE7/SYNC/OC0DHS/TXD1/SCK/CLKOUT/EVOUT) ; port SPIE7_MOSI
SPIJ6_CS2: U7.71(PJ6/SYNC/A10/D6/A6/A14) ; port SPIJ6_CS2
TRX_EN: U7.75(PK0/SYNC/A0/A8/A16) ; port TRX_EN
TRX_INT: U7.76(PK1/SYNC/A1/A9/A17) ; port TRX_INT
TXD_CON: J7.1(RX) U7.52(PF7/SYNC/TXD1/SCK) ; port TXD_CON
UARTE2_RXD: U7.37(PE2/SYNC/ASYNC/OC0C/OC0BLS/RXD0) ; port UARTE2_RXD
UARTE3_TXD: U7.38(PE3/SYNC/OC0D/OC0BHS/TXD0) ; port UARTE3_TXD
UARTF2_RXD: U7.47(PF2/SYNC/ASYNC/OC0C/RXD0) ; port UARTF2_RXD
UARTF3_TXD: U7.48(PF3/SYNC/OC0D/TXD0) ; port UARTF3_TXD
V_CAM3_EN: U7.88(PQ3/SYNC) ; port V_CAM3_EN
V_CAM18_EN: U7.87(PQ2/SYNC/ASYNC) ; port V_CAM18_EN
V_RADIO_EN: U7.86(PQ1/SYNC/TOSC2) ; port V_RADIO_EN
V_SENS_EN: U7.85(PQ0/SYNC/TOSC1) ; port V_SENS_EN
VCC_CAP: J11.1(VCC)

Not connected (* = marked no-connect by the designer): U7 68(PJ3/SYNC//D3/A3/A11) 82(PK7/SYNC/A7/A15/A23) 91(PR0/SYNC/XTAL2) 92(PR1/SYNC/XTAL1) 98(PA3/SYNC/ADC3/AC3/DAC1)

### Buses and harness runs
bus PH[0..7] = port PH[0..7]

### Notes on the sheet
- Project Karman Dev Board
- 1
- 12
- A

### Library data of the parts
C11-C20 = CAP_MURATA_GRM188R70J104KA01D: as C40 on sheet karmanDB_sensors2; Supplier 1: Digi-Key; Supplier Part Number 1: 490-9730-1-ND; Manufacturer Part Number: GRM188R70J104KA01D; RoHS: RoHS Compliant; Category: Capacitors; Stock 1: 25826; Pricing: 1=0.1, 10=0.061, 50=0.0332, 100=0.0281, 250=0.02296, 500=0.01964, 1000=0.0153 (USD); Packaging: Cut Tape (CT); Tolerance: ±10%; Voltage - Rated: 6.3V; Temperature Coefficient: X7R; Mounting Type: Surface Mount, MLCC; Operating Temperature: -55°C ~ 125°C; Applications: General Purpose; Ratings: -; Package / Case: 0603 (1608 Metric); Size / Dimension: 0.063" L x 0.031" W (1.60mm x 0.80mm); Height - Seated (Max): -; Thickness (Max): 0.035" (0.90mm); Lead Spacing: -; Features: -; Lead Style: -; ComponentLink1URL: http://www.murata.com/~/media/webrenewal/support/library/catalog/products/capacitor/mlcc/c02e.ashx; ComponentLink1Description: http://www.murata.com/~/media/webrenewal/support/library/catalog/products/capacitor/mlcc/c02e.ashx
C22 = CAP_MURATA_GRM188R60J106: as C39 on sheet karmanDB_sensors2; Supplier 1: Digi-Key; Supplier Part Number 1: 490-6405-1-ND; RoHS: RoHS Compliant; Category: Capacitors; Stock 1: 159118; Pricing: 1=0.19, 10=0.128, 50=0.0776, 100=0.0651, 250=0.05272, 500=0.0465, 1000=0.03953, 5000=0.03333 (USD); Packaging: Cut Tape (CT); Tolerance: ±20%; Voltage - Rated: 6.3V; Temperature Coefficient: X5R; Mounting Type: Surface Mount, MLCC; Operating Temperature: -55°C ~ 85°C; Applications: General Purpose; Ratings: -; Package / Case: 0603 (1608 Metric); Size / Dimension: 0.063" L x 0.031" W (1.60mm x 0.80mm); Height - Seated (Max): -; Thickness (Max): 0.035" (0.90mm); Lead Spacing: -; Features: -; Lead Style: -; ComponentLink1URL: http://www.murata.com/~/media/webrenewal/support/library/catalog/products/capacitor/mlcc/c02e.ashx; ComponentLink1Description: http://www.murata.com/~/media/webrenewal/support/library/catalog/products/capacitor/mlcc/c02e.ashx
J7 = 961102-6404-AR: CONN HEADER VERT SGL 2POS GOLD; Manufacturer: 3M; Connector Type: Header, Unshrouded; Number of Positions: 2; Number of Positions Loaded: All; Pitch: 0.100" (2.54mm); Supplier 1: Digi-Key; Manufacturer Part Number: 961102-6404-AR; RoHS: RoHS Compliant; Category: Connectors, Interconnects; Stock 1: 60000; Pricing 1: 1=0.16, 10=0.15, 25=0.128, 50=0.112, 100=0.104, 250=0.092, 500=0.088, 1000=0.072, 2500=0.066 (USD); Packaging: Bulk; Contact Type: Male Pin; Number of Rows: 1; Row Spacing: -; Contact Mating Length: 0.217" (5.50mm); Mounting Type: Through Hole; Termination: Solder; Fastening Type: -; Features: -; Contact Finish: Gold; Contact Finish Thickness: Flash; Color: Black; ComponentLink1URL: http://multimedia.3m.com/mws/mediawebserver?66666UuZjcFSLXTtNxTElX&VEVuQEcuZgVs6EVs6E666666--; ComponentLink1Description: http://multimedia.3m.com/mws/mediawebserver?66666UuZjcFSLXTtNxTElX&VEVuQEcuZgVs6EVs6E666666--; Supplier Part Number 1: 3M9447-ND
J11 = 961206-6404-AR: CONN HEADER VERT DUAL 6POS GOLD; Manufacturer: 3M; Connector Type: Header, Unshrouded; Number of Positions: 6; Number of Positions Loaded: All; Pitch: 0.100" (2.54mm); Supplier 1: Digi-Key; Manufacturer Part Number: 961206-6404-AR; RoHS: RoHS Compliant; Category: Connectors, Interconnects; Stock 1: 8455; Pricing 1: 1=0.42, 10=0.39, 25=0.3512, 50=0.312, 100=0.299, 250=0.273, 500=0.26, 1000=0.2145, 2500=0.195 (USD); Packaging: Bulk; Contact Type: Male Pin; Number of Rows: 2; Row Spacing: 0.100" (2.54mm); Contact Mating Length: 0.217" (5.50mm); Mounting Type: Through Hole; Termination: Solder; Fastening Type: -; Features: -; Contact Finish: Gold; Contact Finish Thickness: Flash; Color: Black; ComponentLink1URL: http://multimedia.3m.com/mws/mediawebserver?66666UuZjcFSLXTtNxTElX&VEVuQEcuZgVs6EVs6E666666--; ComponentLink1Description: http://multimedia.3m.com/mws/mediawebserver?66666UuZjcFSLXTtNxTElX&VEVuQEcuZgVs6EVs6E666666--; Supplier Part Number 1: 3M9459-ND
L4 = BLM15BB221SN1D: FERRITE CHIP 220 OHM 200MA 0402; Manufacturer: Murata Electronics North America; Impedance @ Frequency: 220 Ohm @ 100MHz; DC Resistance (DCR): 800 mOhm Max; Filter Type: Differential Mode - Single; Supplier 1: Digi-Key; Manufacturer Part Number: BLM15BB221SN1D; RoHS: RoHS Compliant; Category: Filters; Stock 1: 37626; Pricing 1: 1=0.1, 10=0.083, 50=0.0544, 100=0.047, 250=0.03712, 500=0.03136, 1000=0.0264, 5000=0.02351 (USD); Packaging: Cut Tape (CT); Current Rating: 200mA; Package / Case: 0402 (1005 Metric); Mounting Type: Surface Mount; Height (Max): 0.022" (0.55mm); Size / Dimension: 0.039" L x 0.020" W (1.00mm x 0.50mm); ComponentLink1URL: http://search.murata.co.jp/Ceramy/image/img/PDF/ENG/L0110S0100BLM15B.pdf; ComponentLink1Description: http://search.murata.co.jp/Ceramy/image/img/PDF/ENG/L0110S0100BLM15B.pdf; Supplier Part Number 1: 490-5190-1-ND
U7 = ATxmega128A1-AU: 8/16-bit AVR XMEGA A1 Microcontroller, 1.6-3.6V, 128KB + 8KB Flash, 2KB EEPROM, 8KB SRAM, 100-pin TQFP, Industrial Grade (-40°C to 85°C), Pb-Free; Published: 1-Apr-2010; DatasheetVersion: revK, Feb-2010; PackageVersion: revC, Oct-2001; PackageReference: 100A; Publisher: Altium Limited; PackageDescription: 100-Pin Thin Profile Plastic Quad Flat Pack (TQFP), 14 x 14 x 1.0 mm Body, 0.5 mm Pitch; Supplier 1: Digi-Key; Supplier Part Number 1: ATXMEGA128A1-AU-ND; Supplier 2: Farnell; Supplier Part Number 2: 1704571; Supplier 3: Mouser; Supplier Part Number 3: 556-ATXMEGA128A1-AU; Code_JEDEC: MS-026-AED; ComponentLink1Description: Manufacturer Link; ComponentLink1URL: http://www.atmel.com/products/avr/default.asp?; ComponentLink2Description: ATxmega64A1/128A1/192A1/256A1/384A1 Datasheet; ComponentLink2URL: http://www.atmel.com/dyn/resources/prod_documents/doc8067.pdf; ComponentLink3Description: Atmel.com Home; ComponentLink3URL: http://www.atmel.com